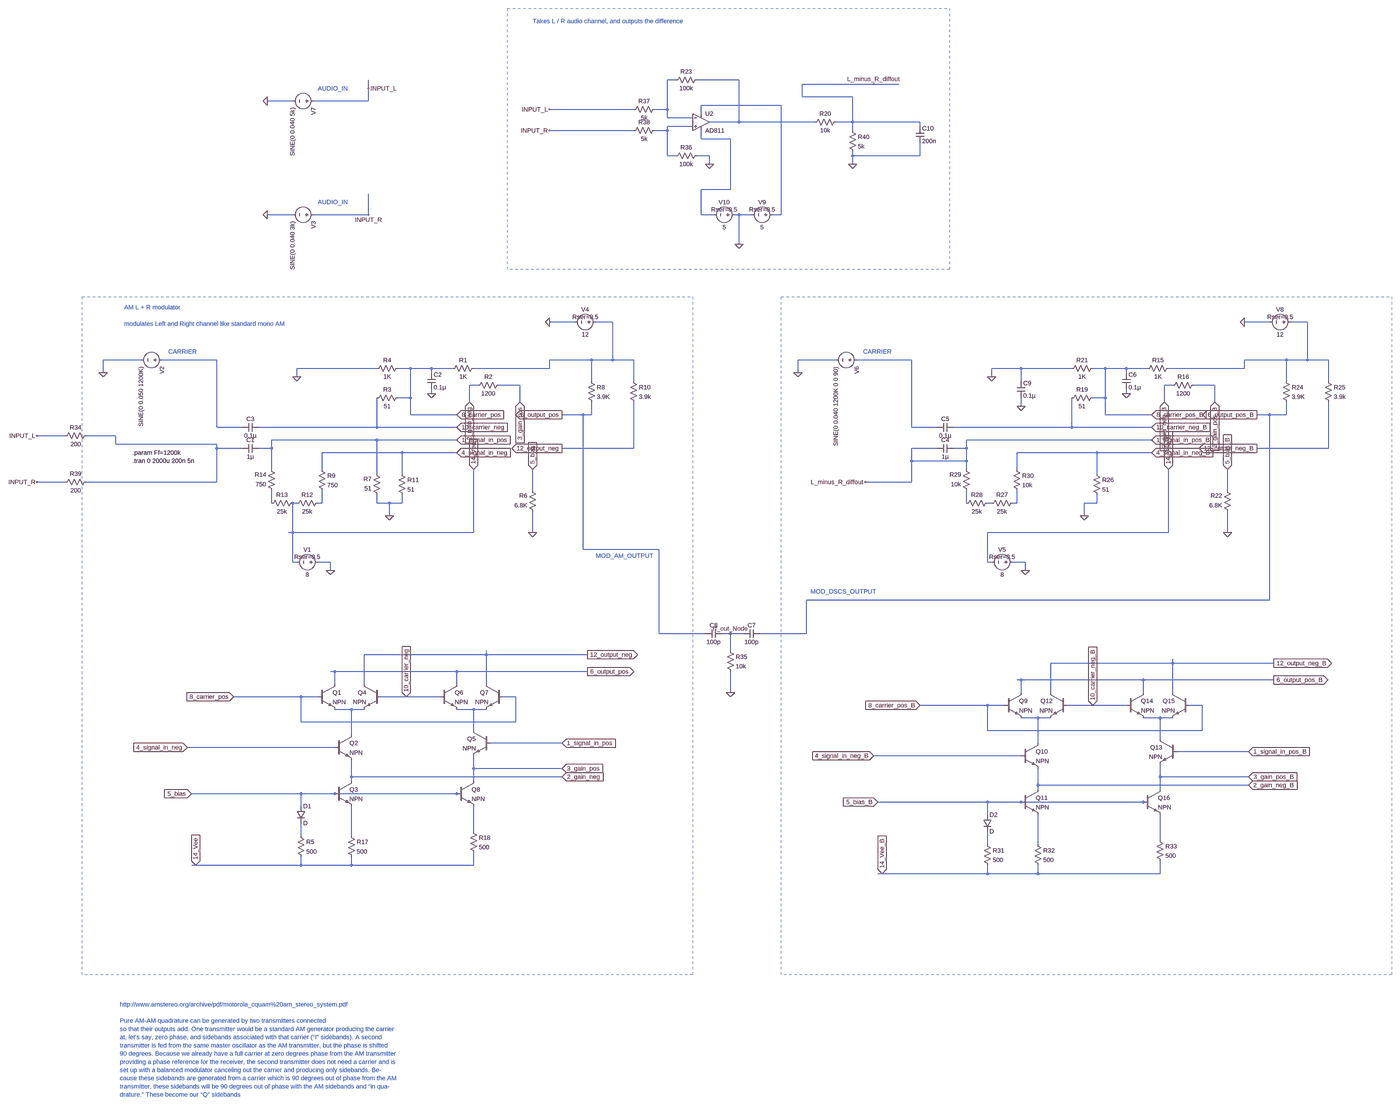
[diagram p0: schematic MC1496_CQUAM_dual.asc, whole sheet]
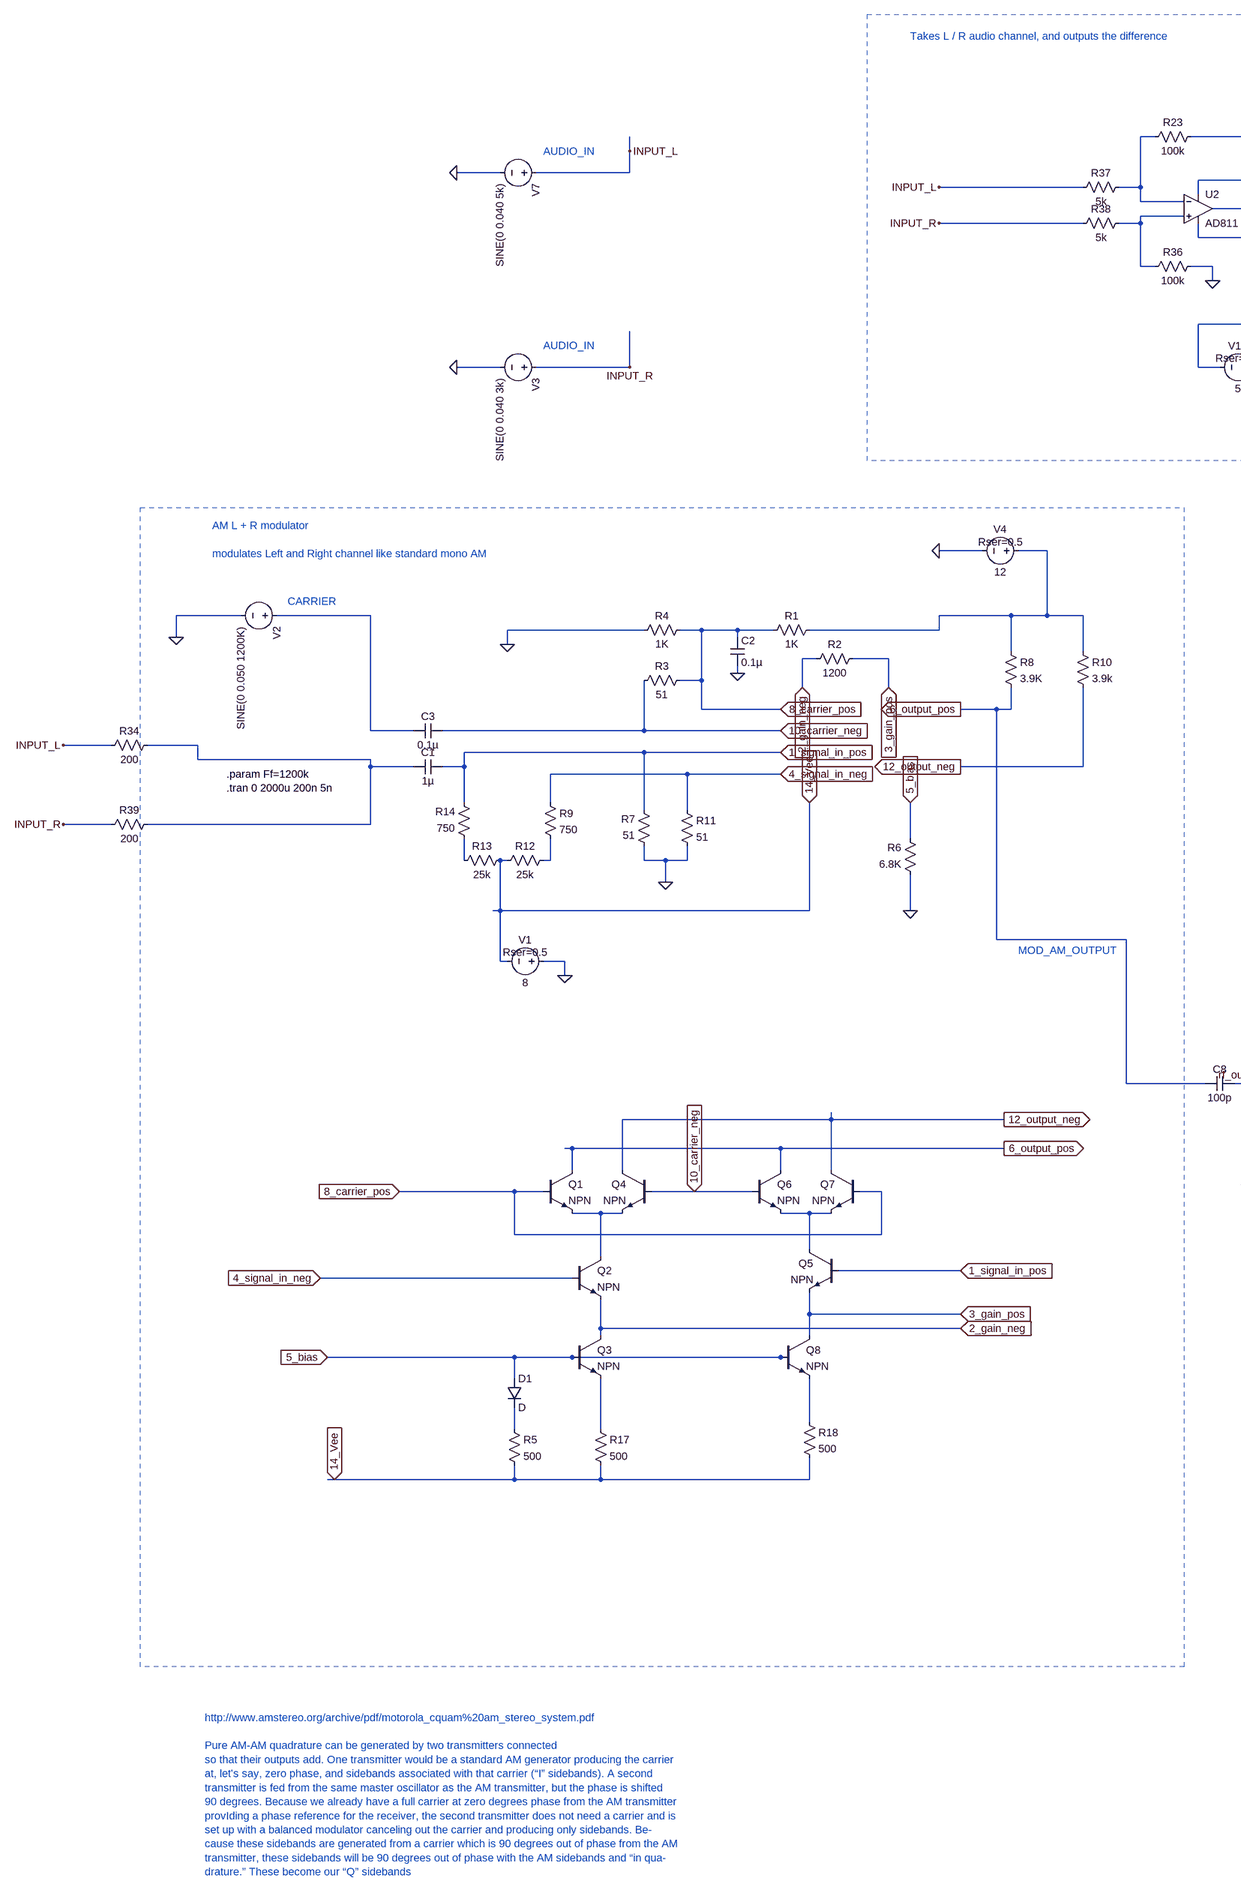
[diagram p1: schematic MC1496_CQUAM_dual.asc, part, row 1 of 1, column 1 of 2]
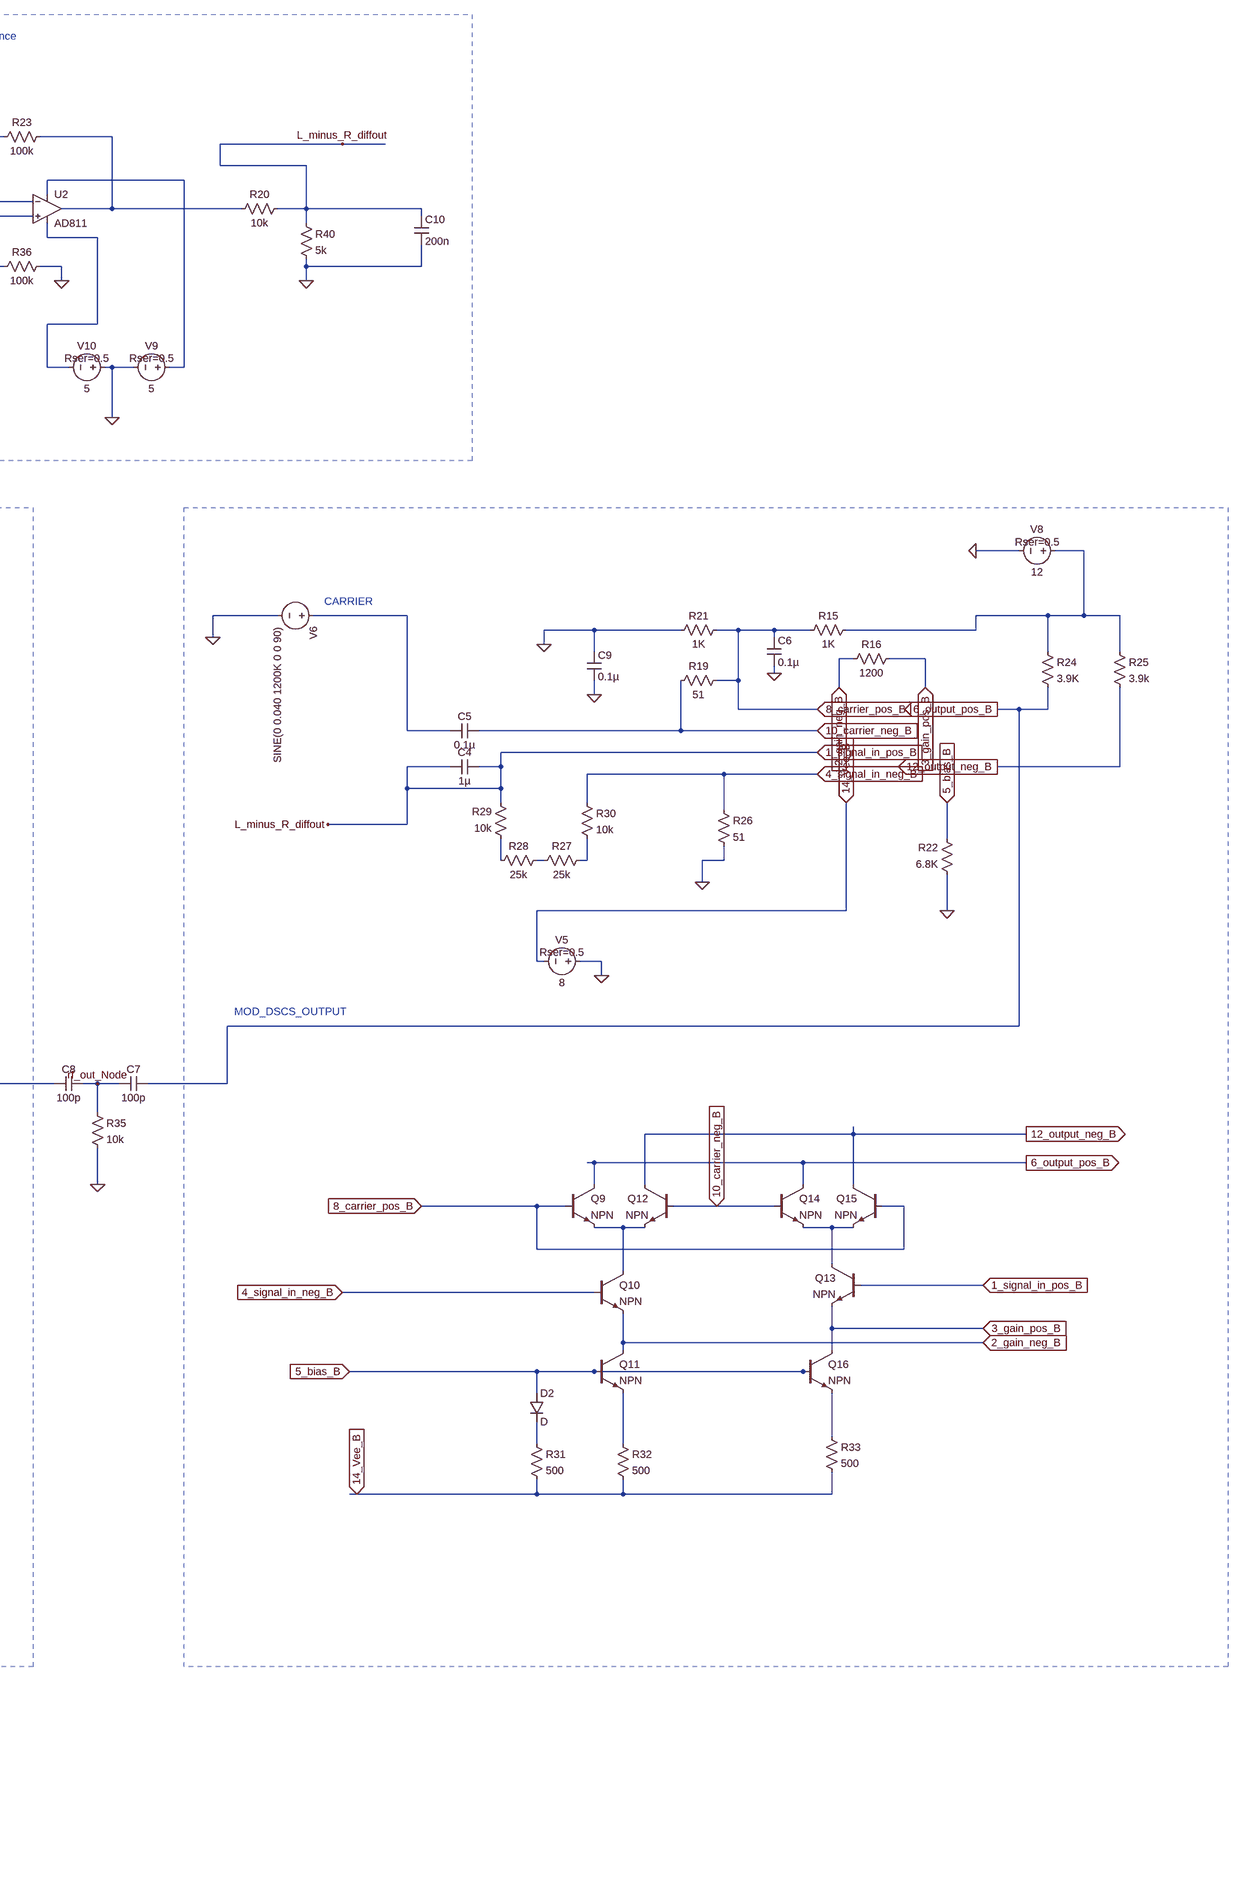
[diagram p2: schematic MC1496_CQUAM_dual.asc, part, row 1 of 1, column 2 of 2]
MC1496_CQUAM_dual.asc, the LTspice schematic file:
Version 4.1
SHEET 1 5516 3196
WIRE 1552 -1456 1520 -1456
WIRE 1792 -1456 1632 -1456
WIRE 2304 -1440 2032 -1440
WIRE 2400 -1440 2304 -1440
WIRE 384 -1424 384 -1456
WIRE 2032 -1392 2032 -1440
WIRE 2224 -1392 2032 -1392
WIRE 96 -1376 0 -1376
WIRE 384 -1376 384 -1424
WIRE 384 -1376 176 -1376
WIRE 1952 -1360 1648 -1360
WIRE 1392 -1344 1072 -1344
WIRE 1520 -1344 1520 -1456
WIRE 1520 -1344 1472 -1344
WIRE 1648 -1328 1648 -1360
WIRE 1520 -1312 1520 -1344
WIRE 1616 -1312 1520 -1312
WIRE 1792 -1296 1792 -1456
WIRE 1792 -1296 1680 -1296
WIRE 2080 -1296 1792 -1296
WIRE 2224 -1296 2224 -1392
WIRE 2224 -1296 2160 -1296
WIRE 2480 -1296 2224 -1296
WIRE 1616 -1280 1520 -1280
WIRE 2480 -1280 2480 -1296
WIRE 1392 -1264 1072 -1264
WIRE 1520 -1264 1520 -1280
WIRE 1520 -1264 1472 -1264
WIRE 2224 -1264 2224 -1296
WIRE 1648 -1232 1648 -1264
WIRE 1760 -1232 1648 -1232
WIRE 1520 -1168 1520 -1264
WIRE 1552 -1168 1520 -1168
WIRE 1680 -1168 1632 -1168
WIRE 2224 -1168 2224 -1184
WIRE 2480 -1168 2480 -1216
WIRE 2480 -1168 2224 -1168
WIRE 1680 -1136 1680 -1168
WIRE 2224 -1136 2224 -1168
WIRE 1760 -1040 1760 -1232
WIRE 1760 -1040 1648 -1040
WIRE 96 -944 0 -944
WIRE 384 -944 384 -1024
WIRE 384 -944 176 -944
WIRE 1648 -944 1648 -1040
WIRE 1696 -944 1648 -944
WIRE 1792 -944 1776 -944
WIRE 1840 -944 1792 -944
WIRE 1952 -944 1952 -1360
WIRE 1952 -944 1920 -944
WIRE 1792 -832 1792 -944
WIRE 1168 -496 1072 -496
WIRE 1312 -496 1248 -496
WIRE 3808 -496 3712 -496
WIRE 3952 -496 3888 -496
WIRE -480 -352 -624 -352
WIRE -192 -352 -400 -352
WIRE 1232 -352 1072 -352
WIRE 1312 -352 1312 -496
WIRE 1312 -352 1232 -352
WIRE 1392 -352 1312 -352
WIRE 2160 -352 2016 -352
WIRE 2448 -352 2240 -352
WIRE 3872 -352 3712 -352
WIRE 3952 -352 3952 -496
WIRE 3952 -352 3872 -352
WIRE 4032 -352 3952 -352
WIRE 416 -320 112 -320
WIRE 544 -320 496 -320
WIRE 624 -320 544 -320
WIRE 704 -320 624 -320
WIRE 1072 -320 1072 -352
WIRE 1072 -320 784 -320
WIRE 2864 -320 2752 -320
WIRE 3056 -320 2864 -320
WIRE 3184 -320 3136 -320
WIRE 3264 -320 3184 -320
WIRE 3344 -320 3264 -320
WIRE 3712 -320 3712 -352
WIRE 3712 -320 3424 -320
WIRE -624 -304 -624 -352
WIRE 624 -304 624 -320
WIRE 2016 -304 2016 -352
WIRE 3264 -304 3264 -320
WIRE 112 -288 112 -320
WIRE 2752 -288 2752 -320
WIRE 1232 -272 1232 -352
WIRE 1392 -272 1392 -352
WIRE 2864 -272 2864 -320
WIRE 3872 -272 3872 -352
WIRE 4032 -272 4032 -352
WIRE 800 -256 768 -256
WIRE 960 -256 880 -256
WIRE 3440 -256 3408 -256
WIRE 3600 -256 3520 -256
WIRE 624 -224 624 -240
WIRE 3264 -224 3264 -240
WIRE 544 -208 544 -320
WIRE 544 -208 496 -208
WIRE 3184 -208 3184 -320
WIRE 3184 -208 3136 -208
WIRE 768 -192 768 -256
WIRE 960 -192 960 -256
WIRE 3408 -192 3408 -256
WIRE 3600 -192 3600 -256
WIRE 2864 -176 2864 -208
WIRE 544 -144 544 -208
WIRE 720 -144 544 -144
WIRE 1200 -144 1120 -144
WIRE 1232 -144 1232 -192
WIRE 1232 -144 1200 -144
WIRE 3184 -144 3184 -208
WIRE 3360 -144 3184 -144
WIRE 3808 -144 3760 -144
WIRE 3872 -144 3872 -192
WIRE 3872 -144 3808 -144
WIRE -192 -96 -192 -352
WIRE -96 -96 -192 -96
WIRE 416 -96 416 -208
WIRE 416 -96 -32 -96
WIRE 720 -96 416 -96
WIRE 2448 -96 2448 -352
WIRE 2544 -96 2448 -96
WIRE 3056 -96 3056 -208
WIRE 3056 -96 2608 -96
WIRE 3360 -96 3056 -96
WIRE -768 -64 -880 -64
WIRE -576 -64 -688 -64
WIRE 416 -48 16 -48
WIRE 720 -48 416 -48
WIRE 3360 -48 2656 -48
WIRE -576 -32 -576 -64
WIRE -192 -32 -576 -32
WIRE -192 -16 -192 -32
WIRE -96 -16 -192 -16
WIRE 16 -16 16 -48
WIRE 16 -16 -32 -16
WIRE 1392 -16 1392 -192
WIRE 1392 -16 1120 -16
WIRE 2544 -16 2448 -16
WIRE 2656 -16 2656 -48
WIRE 2656 -16 2608 -16
WIRE 4032 -16 4032 -192
WIRE 4032 -16 3760 -16
WIRE 512 0 208 0
WIRE 720 0 512 0
WIRE 3152 0 2848 0
WIRE 3360 0 3152 0
WIRE 2448 32 2448 -16
WIRE 2656 32 2656 -16
WIRE 2656 32 2448 32
WIRE 16 64 16 -16
WIRE 208 64 208 0
WIRE 2656 64 2656 32
WIRE 2848 64 2848 0
WIRE 416 80 416 -48
WIRE 512 80 512 0
WIRE 3152 80 3152 0
WIRE -768 112 -880 112
WIRE -192 112 -192 -16
WIRE -192 112 -688 112
WIRE 2448 112 2448 32
WIRE 2448 112 2272 112
WIRE 1008 144 1008 64
WIRE 3648 144 3648 64
WIRE 16 192 16 144
WIRE 112 192 96 192
WIRE 208 192 208 144
WIRE 208 192 192 192
WIRE 416 192 416 160
WIRE 464 192 416 192
WIRE 512 192 512 160
WIRE 512 192 464 192
WIRE 2656 192 2656 144
WIRE 2752 192 2736 192
WIRE 2848 192 2848 144
WIRE 2848 192 2832 192
WIRE 3152 192 3152 160
WIRE 3152 192 3104 192
WIRE 464 240 464 192
WIRE 3104 240 3104 192
WIRE 96 304 96 192
WIRE 96 304 80 304
WIRE 784 304 784 64
WIRE 784 304 96 304
WIRE 1008 304 1008 224
WIRE 3424 304 3424 64
WIRE 3424 304 2736 304
WIRE 3648 304 3648 224
WIRE 1200 368 1200 -144
WIRE 1488 368 1200 368
WIRE 96 416 96 304
WIRE 112 416 96 416
WIRE 240 416 192 416
WIRE 2736 416 2736 304
WIRE 2752 416 2736 416
WIRE 2880 416 2832 416
WIRE 240 448 240 416
WIRE 2880 448 2880 416
WIRE 3808 560 3808 -144
WIRE 3808 560 2048 560
WIRE 1488 688 1488 368
WIRE 1664 688 1488 688
WIRE 1760 688 1728 688
WIRE 1808 688 1760 688
WIRE 2048 688 2048 560
WIRE 2048 688 1872 688
WIRE 1760 752 1760 688
WIRE 832 768 832 752
WIRE 832 768 368 768
WIRE 1216 768 832 768
WIRE 3440 800 3440 784
WIRE 3440 800 2976 800
WIRE 3824 800 3440 800
WIRE 256 832 240 832
WIRE 720 832 256 832
WIRE 1216 832 720 832
WIRE 2864 864 2848 864
WIRE 3328 864 2864 864
WIRE 3824 864 3328 864
WIRE 256 880 256 832
WIRE 368 880 368 768
WIRE 720 880 720 832
WIRE 832 880 832 768
WIRE 1760 912 1760 832
WIRE 2864 912 2864 864
WIRE 2976 912 2976 800
WIRE 3328 912 3328 864
WIRE 3440 912 3440 800
WIRE 128 928 -128 928
WIRE 192 928 128 928
WIRE 528 928 432 928
WIRE 656 928 528 928
WIRE 944 928 896 928
WIRE 2736 960 2480 960
WIRE 2800 960 2736 960
WIRE 3136 960 3040 960
WIRE 3264 960 3136 960
WIRE 3552 960 3504 960
WIRE 320 976 256 976
WIRE 368 976 320 976
WIRE 784 976 720 976
WIRE 832 976 784 976
WIRE 2928 1008 2864 1008
WIRE 2976 1008 2928 1008
WIRE 3392 1008 3328 1008
WIRE 3440 1008 3392 1008
WIRE 128 1024 128 928
WIRE 944 1024 944 928
WIRE 944 1024 128 1024
WIRE 784 1056 784 976
WIRE 2736 1056 2736 960
WIRE 3552 1056 3552 960
WIRE 3552 1056 2736 1056
WIRE 320 1072 320 976
WIRE 3392 1088 3392 1008
WIRE 1120 1104 848 1104
WIRE 2928 1104 2928 1008
WIRE 256 1120 -304 1120
WIRE 3728 1136 3456 1136
WIRE 2864 1152 2304 1152
WIRE 784 1200 784 1152
WIRE 1120 1200 784 1200
WIRE 320 1232 320 1168
WIRE 1120 1232 320 1232
WIRE 3392 1232 3392 1184
WIRE 3728 1232 3392 1232
WIRE 320 1248 320 1232
WIRE 784 1248 784 1200
WIRE 2928 1264 2928 1200
WIRE 3728 1264 2928 1264
WIRE 2928 1280 2928 1264
WIRE 3392 1280 3392 1232
WIRE 128 1296 -288 1296
WIRE 256 1296 128 1296
WIRE 720 1296 256 1296
WIRE 736 1296 720 1296
WIRE 2736 1328 2320 1328
WIRE 2864 1328 2736 1328
WIRE 3328 1328 2864 1328
WIRE 3344 1328 3328 1328
WIRE 128 1344 128 1296
WIRE 2736 1376 2736 1328
WIRE 784 1440 784 1344
WIRE 128 1456 128 1408
WIRE 320 1456 320 1344
WIRE 3392 1472 3392 1376
WIRE 2736 1488 2736 1440
WIRE 2928 1488 2928 1376
WIRE -272 1568 -288 1568
WIRE 128 1568 128 1536
WIRE 128 1568 -272 1568
WIRE 320 1568 320 1536
WIRE 320 1568 128 1568
WIRE 784 1568 784 1520
WIRE 784 1568 320 1568
WIRE 2336 1600 2320 1600
WIRE 2736 1600 2736 1568
WIRE 2736 1600 2336 1600
WIRE 2928 1600 2928 1568
WIRE 2928 1600 2736 1600
WIRE 3392 1600 3392 1552
WIRE 3392 1600 2928 1600
FLAG 240 448 0
FLAG 0 -944 0
FLAG 1008 304 0
FLAG 112 -288 0
FLAG 464 240 0
FLAG 624 -224 0
FLAG -624 -304 0
FLAG 1072 -496 0
FLAG 528 928 10_carrier_neg
IOPIN 528 928 In
FLAG -128 928 8_carrier_pos
IOPIN -128 928 In
FLAG 1120 1104 1_signal_in_pos
IOPIN 1120 1104 In
FLAG -304 1120 4_signal_in_neg
IOPIN -304 1120 In
FLAG -288 1296 5_bias
IOPIN -288 1296 In
FLAG -272 1568 14_Vee
IOPIN -272 1568 In
FLAG 1216 768 12_output_neg
IOPIN 1216 768 Out
FLAG 1216 832 6_output_pos
IOPIN 1216 832 Out
FLAG 1120 1200 3_gain_pos
IOPIN 1120 1200 In
FLAG 1120 1232 2_gain_neg
IOPIN 1120 1232 In
FLAG 720 -144 8_carrier_pos
IOPIN 720 -144 In
FLAG 720 -96 10_carrier_neg
IOPIN 720 -96 In
FLAG 720 -48 1_signal_in_pos
IOPIN 720 -48 In
FLAG 720 0 4_signal_in_neg
IOPIN 720 0 In
FLAG 784 64 14_Vee
IOPIN 784 64 In
FLAG 1008 64 5_bias
IOPIN 1008 64 In
FLAG 1120 -16 12_output_neg
IOPIN 1120 -16 Out
FLAG 1120 -144 6_output_pos
IOPIN 1120 -144 Out
FLAG 768 -192 2_gain_neg
IOPIN 768 -192 In
FLAG 960 -192 3_gain_pos
IOPIN 960 -192 In
FLAG 2880 448 0
FLAG 0 -1376 0
FLAG 3648 304 0
FLAG 2752 -288 0
FLAG 3104 240 0
FLAG 3264 -224 0
FLAG 2016 -304 0
FLAG 3712 -496 0
FLAG 3136 960 10_carrier_neg_B
IOPIN 3136 960 In
FLAG 2480 960 8_carrier_pos_B
IOPIN 2480 960 In
FLAG 3728 1136 1_signal_in_pos_B
IOPIN 3728 1136 In
FLAG 2304 1152 4_signal_in_neg_B
IOPIN 2304 1152 In
FLAG 2320 1328 5_bias_B
IOPIN 2320 1328 In
FLAG 2336 1600 14_Vee_B
IOPIN 2336 1600 In
FLAG 3824 800 12_output_neg_B
IOPIN 3824 800 Out
FLAG 3824 864 6_output_pos_B
IOPIN 3824 864 Out
FLAG 3728 1232 3_gain_pos_B
IOPIN 3728 1232 In
FLAG 3728 1264 2_gain_neg_B
IOPIN 3728 1264 In
FLAG 3360 -144 8_carrier_pos_B
IOPIN 3360 -144 In
FLAG 3360 -96 10_carrier_neg_B
IOPIN 3360 -96 In
FLAG 3360 -48 1_signal_in_pos_B
IOPIN 3360 -48 In
FLAG 3360 0 4_signal_in_neg_B
IOPIN 3360 0 In
FLAG 3424 64 14_Vee_B
IOPIN 3424 64 In
FLAG 3648 64 5_bias_B
IOPIN 3648 64 In
FLAG 3760 -16 12_output_neg_B
IOPIN 3760 -16 Out
FLAG 3760 -144 6_output_pos_B
IOPIN 3760 -144 Out
FLAG 3408 -192 2_gain_neg_B
IOPIN 3408 -192 In
FLAG 3600 -192 3_gain_pos_B
IOPIN 3600 -192 In
FLAG 1760 912 0
FLAG 1760 688 rf_out_Node
FLAG 2864 -176 0
FLAG 1680 -1136 0
FLAG 1072 -1344 INPUT_L
FLAG 1072 -1264 INPUT_R
FLAG 384 -944 INPUT_R
FLAG 384 -1424 INPUT_L
FLAG 2224 -1136 0
FLAG 1792 -832 0
FLAG 2304 -1440 L_minus_R_diffout
FLAG 2272 112 L_minus_R_diffout
FLAG -880 -64 INPUT_L
FLAG -880 112 INPUT_R
DATAFLAG 2480 560 ""
DATAFLAG 2192 560 ""
DATAFLAG 2192 560 ""
SYMBOL res 800 -336 R90
WINDOW 0 0 56 VBottom 2
WINDOW 3 32 56 VTop 2
SYMATTR InstName R1
SYMATTR Value 1K
SYMBOL res 896 -272 R90
WINDOW 0 0 56 VBottom 2
WINDOW 3 32 56 VTop 2
SYMATTR InstName R2
SYMATTR Value 1200
SYMBOL res 400 -192 R270
WINDOW 0 32 56 VTop 2
WINDOW 3 0 56 VBottom 2
SYMATTR InstName R3
SYMATTR Value 51
SYMBOL res 400 -304 R270
WINDOW 0 32 56 VTop 2
WINDOW 3 0 56 VBottom 2
SYMATTR InstName R4
SYMATTR Value 1K
SYMBOL res 1024 240 R180
WINDOW 0 36 76 Left 2
WINDOW 3 36 40 Left 2
SYMATTR InstName R6
SYMATTR Value 6.8K
SYMBOL res 432 176 R180
WINDOW 0 36 76 Left 2
WINDOW 3 36 40 Left 2
SYMATTR InstName R7
SYMATTR Value 51
SYMBOL res 1216 -288 R0
SYMATTR InstName R8
SYMATTR Value 3.9K
SYMBOL cap -32 -32 R90
WINDOW 0 0 32 VBottom 2
WINDOW 3 32 32 VTop 2
SYMATTR InstName C1
SYMATTR Value 1µ
SYMBOL cap -32 -112 R90
WINDOW 0 0 32 VBottom 2
WINDOW 3 32 32 VTop 2
SYMATTR InstName C3
SYMATTR Value 0.1µ
SYMBOL voltage 208 416 R90
WINDOW 0 -32 56 VBottom 2
WINDOW 3 32 56 VTop 2
WINDOW 123 0 0 Left 0
WINDOW 39 -4 56 VBottom 2
SYMATTR InstName V1
SYMATTR Value 8
SYMATTR SpiceLine Rser=0.5
SYMBOL voltage -384 -352 R90
WINDOW 123 0 0 Left 0
WINDOW 39 0 0 Left 0
SYMATTR InstName V2
SYMATTR Value SINE(0 0.050 1200K)
SYMBOL voltage 192 -944 R90
WINDOW 123 0 0 Left 0
WINDOW 39 0 0 Left 0
SYMATTR InstName V3
SYMATTR Value SINE(0 0.040 3k)
SYMBOL res 1376 -288 R0
SYMATTR InstName R10
SYMATTR Value 3.9k
SYMBOL res 496 64 R0
SYMATTR InstName R11
SYMATTR Value 51
SYMBOL res 208 176 R90
WINDOW 0 0 56 VBottom 2
WINDOW 3 32 56 VTop 2
SYMATTR InstName R12
SYMATTR Value 25k
SYMBOL res 112 176 R90
WINDOW 0 0 56 VBottom 2
WINDOW 3 32 56 VTop 2
SYMATTR InstName R13
SYMATTR Value 25k
SYMBOL res 32 160 R180
WINDOW 0 36 76 Left 2
WINDOW 3 36 40 Left 2
SYMATTR InstName R14
SYMATTR Value 750
SYMBOL res 192 48 R0
SYMATTR InstName R9
SYMATTR Value 750
SYMBOL cap 608 -304 R0
SYMATTR InstName C2
SYMATTR Value 0.1µ
SYMBOL voltage 1264 -496 R90
WINDOW 0 -32 56 VBottom 2
WINDOW 3 32 56 VTop 2
WINDOW 123 0 0 Left 0
WINDOW 39 -4 56 VBottom 2
SYMATTR InstName V4
SYMATTR Value 12
SYMATTR SpiceLine Rser=0.5
SYMBOL npn 192 880 R0
SYMATTR InstName Q1
SYMBOL npn 256 1072 R0
SYMATTR InstName Q2
SYMBOL npn 256 1248 R0
SYMATTR InstName Q3
SYMBOL diode 112 1344 R0
SYMATTR InstName D1
SYMBOL res 112 1440 R0
SYMATTR InstName R5
SYMATTR Value 500
SYMBOL res 304 1440 R0
SYMATTR InstName R17
SYMATTR Value 500
SYMBOL npn 432 880 M0
SYMATTR InstName Q4
SYMBOL npn 848 1056 M0
SYMATTR InstName Q5
SYMBOL npn 656 880 R0
SYMATTR InstName Q6
SYMBOL npn 896 880 M0
SYMATTR InstName Q7
SYMBOL npn 720 1248 R0
SYMATTR InstName Q8
SYMBOL res 768 1424 R0
SYMATTR InstName R18
SYMATTR Value 500
SYMBOL res 3440 -336 R90
WINDOW 0 0 56 VBottom 2
WINDOW 3 32 56 VTop 2
SYMATTR InstName R15
SYMATTR Value 1K
SYMBOL res 3536 -272 R90
WINDOW 0 0 56 VBottom 2
WINDOW 3 32 56 VTop 2
SYMATTR InstName R16
SYMATTR Value 1200
SYMBOL res 3040 -192 R270
WINDOW 0 32 56 VTop 2
WINDOW 3 0 56 VBottom 2
SYMATTR InstName R19
SYMATTR Value 51
SYMBOL res 3040 -304 R270
WINDOW 0 32 56 VTop 2
WINDOW 3 0 56 VBottom 2
SYMATTR InstName R21
SYMATTR Value 1K
SYMBOL res 3664 240 R180
WINDOW 0 36 76 Left 2
WINDOW 3 36 40 Left 2
SYMATTR InstName R22
SYMATTR Value 6.8K
SYMBOL res 3856 -288 R0
SYMATTR InstName R24
SYMATTR Value 3.9K
SYMBOL cap 2608 -32 R90
WINDOW 0 0 32 VBottom 2
WINDOW 3 32 32 VTop 2
SYMATTR InstName C4
SYMATTR Value 1µ
SYMBOL cap 2608 -112 R90
WINDOW 0 0 32 VBottom 2
WINDOW 3 32 32 VTop 2
SYMATTR InstName C5
SYMATTR Value 0.1µ
SYMBOL voltage 2848 416 R90
WINDOW 0 -32 56 VBottom 2
WINDOW 3 32 56 VTop 2
WINDOW 123 0 0 Left 0
WINDOW 39 -4 56 VBottom 2
SYMATTR InstName V5
SYMATTR Value 8
SYMATTR SpiceLine Rser=0.5
SYMBOL voltage 2256 -352 R90
WINDOW 123 0 0 Left 0
WINDOW 39 0 0 Left 0
SYMATTR InstName V6
SYMATTR Value SINE(0 0.040 1200K 0 0 90)
SYMBOL voltage 192 -1376 R90
WINDOW 123 0 0 Left 0
WINDOW 39 0 0 Left 0
SYMATTR InstName V7
SYMATTR Value SINE(0 0.040 5k)
SYMBOL res 4016 -288 R0
SYMATTR InstName R25
SYMATTR Value 3.9k
SYMBOL res 3136 64 R0
SYMATTR InstName R26
SYMATTR Value 51
SYMBOL res 2848 176 R90
WINDOW 0 0 56 VBottom 2
WINDOW 3 32 56 VTop 2
SYMATTR InstName R27
SYMATTR Value 25k
SYMBOL res 2752 176 R90
WINDOW 0 0 56 VBottom 2
WINDOW 3 32 56 VTop 2
SYMATTR InstName R28
SYMATTR Value 25k
SYMBOL res 2672 160 R180
WINDOW 0 36 76 Left 2
WINDOW 3 36 40 Left 2
SYMATTR InstName R29
SYMATTR Value 10k
SYMBOL res 2832 48 R0
SYMATTR InstName R30
SYMATTR Value 10k
SYMBOL cap 3248 -304 R0
SYMATTR InstName C6
SYMATTR Value 0.1µ
SYMBOL voltage 3904 -496 R90
WINDOW 0 -32 56 VBottom 2
WINDOW 3 32 56 VTop 2
WINDOW 123 0 0 Left 0
WINDOW 39 -4 56 VBottom 2
SYMATTR InstName V8
SYMATTR Value 12
SYMATTR SpiceLine Rser=0.5
SYMBOL npn 2800 912 R0
SYMATTR InstName Q9
SYMBOL npn 2864 1104 R0
SYMATTR InstName Q10
SYMBOL npn 2864 1280 R0
SYMATTR InstName Q11
SYMBOL diode 2720 1376 R0
SYMATTR InstName D2
SYMBOL res 2720 1472 R0
SYMATTR InstName R31
SYMATTR Value 500
SYMBOL res 2912 1472 R0
SYMATTR InstName R32
SYMATTR Value 500
SYMBOL npn 3040 912 M0
SYMATTR InstName Q12
SYMBOL npn 3456 1088 M0
SYMATTR InstName Q13
SYMBOL npn 3264 912 R0
SYMATTR InstName Q14
SYMBOL npn 3504 912 M0
SYMATTR InstName Q15
SYMBOL npn 3328 1280 R0
SYMATTR InstName Q16
SYMBOL res 3376 1456 R0
SYMATTR InstName R33
SYMATTR Value 500
SYMBOL cap 1872 672 R90
WINDOW 0 0 32 VBottom 2
WINDOW 3 32 32 VTop 2
SYMATTR InstName C7
SYMATTR Value 100p
SYMBOL cap 1728 672 R90
WINDOW 0 0 32 VBottom 2
WINDOW 3 32 32 VTop 2
SYMATTR InstName C8
SYMATTR Value 100p
SYMBOL res 1744 736 R0
SYMATTR InstName R35
SYMATTR Value 10k
SYMBOL cap 2848 -272 R0
SYMATTR InstName C9
SYMATTR Value 0.1µ
SYMBOL OpAmps\\AD811 1648 -1360 R0
SYMATTR InstName U2
SYMBOL res 1648 -1472 R90
WINDOW 0 0 56 VBottom 2
WINDOW 3 32 56 VTop 2
SYMATTR InstName R23
SYMATTR Value 100k
SYMBOL res 1648 -1184 R90
WINDOW 0 0 56 VBottom 2
WINDOW 3 32 56 VTop 2
SYMATTR InstName R36
SYMATTR Value 100k
SYMBOL res 1488 -1360 R90
WINDOW 0 0 56 VBottom 2
WINDOW 3 32 56 VTop 2
SYMATTR InstName R37
SYMATTR Value 5k
SYMBOL res 1488 -1280 R90
WINDOW 0 0 56 VBottom 2
WINDOW 3 32 56 VTop 2
SYMATTR InstName R38
SYMATTR Value 5k
SYMBOL res 2176 -1312 R90
WINDOW 0 0 56 VBottom 2
WINDOW 3 32 56 VTop 2
SYMATTR InstName R20
SYMATTR Value 10k
SYMBOL voltage 1936 -944 R90
WINDOW 0 -32 56 VBottom 2
WINDOW 3 32 56 VTop 2
WINDOW 123 0 0 Left 0
WINDOW 39 -4 56 VBottom 2
SYMATTR InstName V9
SYMATTR Value 5
SYMATTR SpiceLine Rser=0.5
SYMBOL voltage 1792 -944 R90
WINDOW 0 -32 56 VBottom 2
WINDOW 3 32 56 VTop 2
WINDOW 123 0 0 Left 0
WINDOW 39 -4 56 VBottom 2
SYMATTR InstName V10
SYMATTR Value 5
SYMATTR SpiceLine Rser=0.5
SYMBOL res -672 -80 R90
WINDOW 0 0 56 VBottom 2
WINDOW 3 32 56 VTop 2
SYMATTR InstName R34
SYMATTR Value 200
SYMBOL res -672 96 R90
WINDOW 0 0 56 VBottom 2
WINDOW 3 32 56 VTop 2
SYMATTR InstName R39
SYMATTR Value 200
SYMBOL res 2208 -1280 R0
SYMATTR InstName R40
SYMATTR Value 5k
SYMBOL cap 2464 -1280 R0
SYMATTR InstName C10
SYMATTR Value 200n
TEXT -376 -384 Left 2 ;CARRIER
TEXT 192 -992 Left 2 ;AUDIO_IN
TEXT 1248 392 Left 2 ;MOD_AM_OUTPUT
TEXT -512 0 Left 2 !.param Ff=1200k\n.tran 0 2000u 200n 5n
TEXT 2264 -384 Left 2 ;CARRIER
TEXT 192 -1424 Left 2 ;AUDIO_IN
TEXT 2064 528 Left 2 ;MOD_DSCS_OUTPUT
TEXT 1008 -1680 Left 2 ;Takes L / R audio channel, and outputs the difference
TEXT -544 -552 Left 2 ;AM L + R modulator\n \nmodulates Left and Right channel like standard mono AM
TEXT -560 2160 Left 2 ;http://www.amstereo.org/archive/pdf/motorola_cquam%20am_stereo_system.pdf\n \nPure AM-AM quadrature can be generated by two transmitters connected\nso that their outputs add. One transmitter would be a standard AM generator producing the carrier\nat, let's say, zero phase, and sidebands associated with that carrier (“I” sidebands). A second\ntransmitter is fed from the same master oscillator as the AM transmitter, but the phase is shifted\n90 degrees. Because we already have a full carrier at zero degrees phase from the AM transmitter\nprovIding a phase reference for the receiver, the second transmitter does not need a carrier and is\nset up with a balanced modulator canceling out the carrier and producing only sidebands. Be-\ncause these sidebands are generated from a carrier which is 90 degrees out of phase from the AM\ntransmitter, these sidebands will be 90 degrees out of phase with the AM sidebands and “in qua-\ndrature.” These become our “Q” sidebands
RECTANGLE Normal 1616 1984 -704 -592 2
RECTANGLE Normal 4272 1984 1952 -592 2
RECTANGLE Normal 2592 -736 912 -1728 2

The netlist it stands for:
* MC1496_CQUAM_dual.asc
R1 N006 8_carrier_pos 1K
R2 3_gain_pos 2_gain_neg 1200
R3 10_carrier_neg 8_carrier_pos 51
R4 0 8_carrier_pos 1K
R6 0 5_bias 6.8K
R7 0 1_signal_in_pos 51
R8 N006 6_output_pos 3.9K
C1 1_signal_in_pos N010 1µ
C3 10_carrier_neg N008 0.1µ
V1 0 14_Vee 8 Rser=0.5
V2 N008 0 SINE(0 0.050 1200K)
V3 INPUT_R 0 SINE(0 0.040 3k)
R10 N006 12_output_neg 3.9k
R11 4_signal_in_neg 0 51
R12 N012 14_Vee 25k
R13 14_Vee N011 25k
R14 N011 1_signal_in_pos 750
R9 4_signal_in_neg N012 750
C2 8_carrier_pos 0 0.1µ
V4 N006 0 12 Rser=0.5
Q1 6_output_pos 8_carrier_pos N016 0 NPN
Q2 N016 4_signal_in_neg 2_gain_neg 0 NPN
Q3 2_gain_neg 5_bias N022 0 NPN
D1 5_bias N021 D
R5 N021 14_Vee 500
R17 N022 14_Vee 500
Q4 12_output_neg 10_carrier_neg N016 0 NPN
Q5 N017 1_signal_in_pos 3_gain_pos 0 NPN
Q6 6_output_pos 10_carrier_neg N017 0 NPN
Q7 12_output_neg 8_carrier_pos N017 0 NPN
Q8 3_gain_pos 5_bias N020 0 NPN
R18 N020 14_Vee 500
R15 N007 8_carrier_pos_B 1K
R16 3_gain_pos_B 2_gain_neg_B 1200
R19 10_carrier_neg_B 8_carrier_pos_B 51
R21 0 8_carrier_pos_B 1K
R22 0 5_bias_B 6.8K
R24 N007 6_output_pos_B 3.9K
C4 L_minus_R_diffout L_minus_R_diffout 1µ
C5 10_carrier_neg_B N009 0.1µ
V5 0 14_Vee_B 8 Rser=0.5
V6 N009 0 SINE(0 0.040 1200K 0 0 90)
V7 INPUT_L 0 SINE(0 0.040 5k)
R25 N007 12_output_neg_B 3.9k
R26 4_signal_in_neg_B 0 51
R27 N015 N014 25k
R28 N014 N013 25k
R29 N013 L_minus_R_diffout 10k
R30 4_signal_in_neg_B N015 10k
C6 8_carrier_pos_B 0 0.1µ
V8 N007 0 12 Rser=0.5
Q9 6_output_pos_B 8_carrier_pos_B N018 0 NPN
Q10 N018 4_signal_in_neg_B 2_gain_neg_B 0 NPN
Q11 2_gain_neg_B 5_bias_B N025 0 NPN
D2 5_bias_B N024 D
R31 N024 14_Vee_B 500
R32 N025 14_Vee_B 500
Q12 12_output_neg_B 10_carrier_neg_B N018 0 NPN
Q13 N019 L_minus_R_diffout 3_gain_pos_B 0 NPN
Q14 6_output_pos_B 10_carrier_neg_B N019 0 NPN
Q15 12_output_neg_B 8_carrier_pos_B N019 0 NPN
Q16 3_gain_pos_B 5_bias_B N023 0 NPN
R33 N023 14_Vee_B 500
C7 6_output_pos_B rf_out_Node 100p
C8 rf_out_Node 6_output_pos 100p
R35 rf_out_Node 0 10k
C9 0 0 0.1µ
X§U2 N004 N001 N003 N005 N002 AD811  ; pins In+ In- V+ V- OUT
R23 N002 N001 100k
R36 0 N004 100k
R37 N001 INPUT_L 5k
R38 N004 INPUT_R 5k
R20 L_minus_R_diffout N002 10k
V9 N003 0 5 Rser=0.5
V10 0 N005 5 Rser=0.5
R34 N010 INPUT_L 200
R39 N010 INPUT_R 200
R40 L_minus_R_diffout 0 5k
C10 L_minus_R_diffout 0 200n
.model D D
.lib standard.dio
.model NPN NPN
.model PNP PNP
.lib standard.bjt
* CARRIER
* AUDIO_IN
* MOD_AM_OUTPUT
.param Ff=1200k
.tran 0 2000u 200n 5n
* CARRIER
* AUDIO_IN
* MOD_DSCS_OUTPUT
* Takes L / R audio channel, and outputs the difference
* AM L + R modulator
* modulates Left and Right channel like standard mono AM
* http://www.amstereo.org/archive/pdf/motorola_cquam%20am_stereo_system.pdf
* Pure AM-AM quadrature can be generated by two transmitters connected
* so that their outputs add. One transmitter would be a standard AM generator producing the carrier
* at, let's say, zero phase, and sidebands associated with that carrier (“I” sidebands). A second
* transmitter is fed from the same master oscillator as the AM transmitter, but the phase is shifted
* 90 degrees. Because we already have a full carrier at zero degrees phase from the AM transmitter
* provIding a phase reference for the receiver, the second transmitter does not need a carrier and is
* set up with a balanced modulator canceling out the carrier and producing only sidebands. Be-
* cause these sidebands are generated from a carrier which is 90 degrees out of phase from the AM
* transmitter, these sidebands will be 90 degrees out of phase with the AM sidebands and “in qua-
* drature.” These become our “Q” sidebands
.backanno
.end